# EAGLE design bubbledisplayfrontpack.v01 (EAGLE 6.6.0)
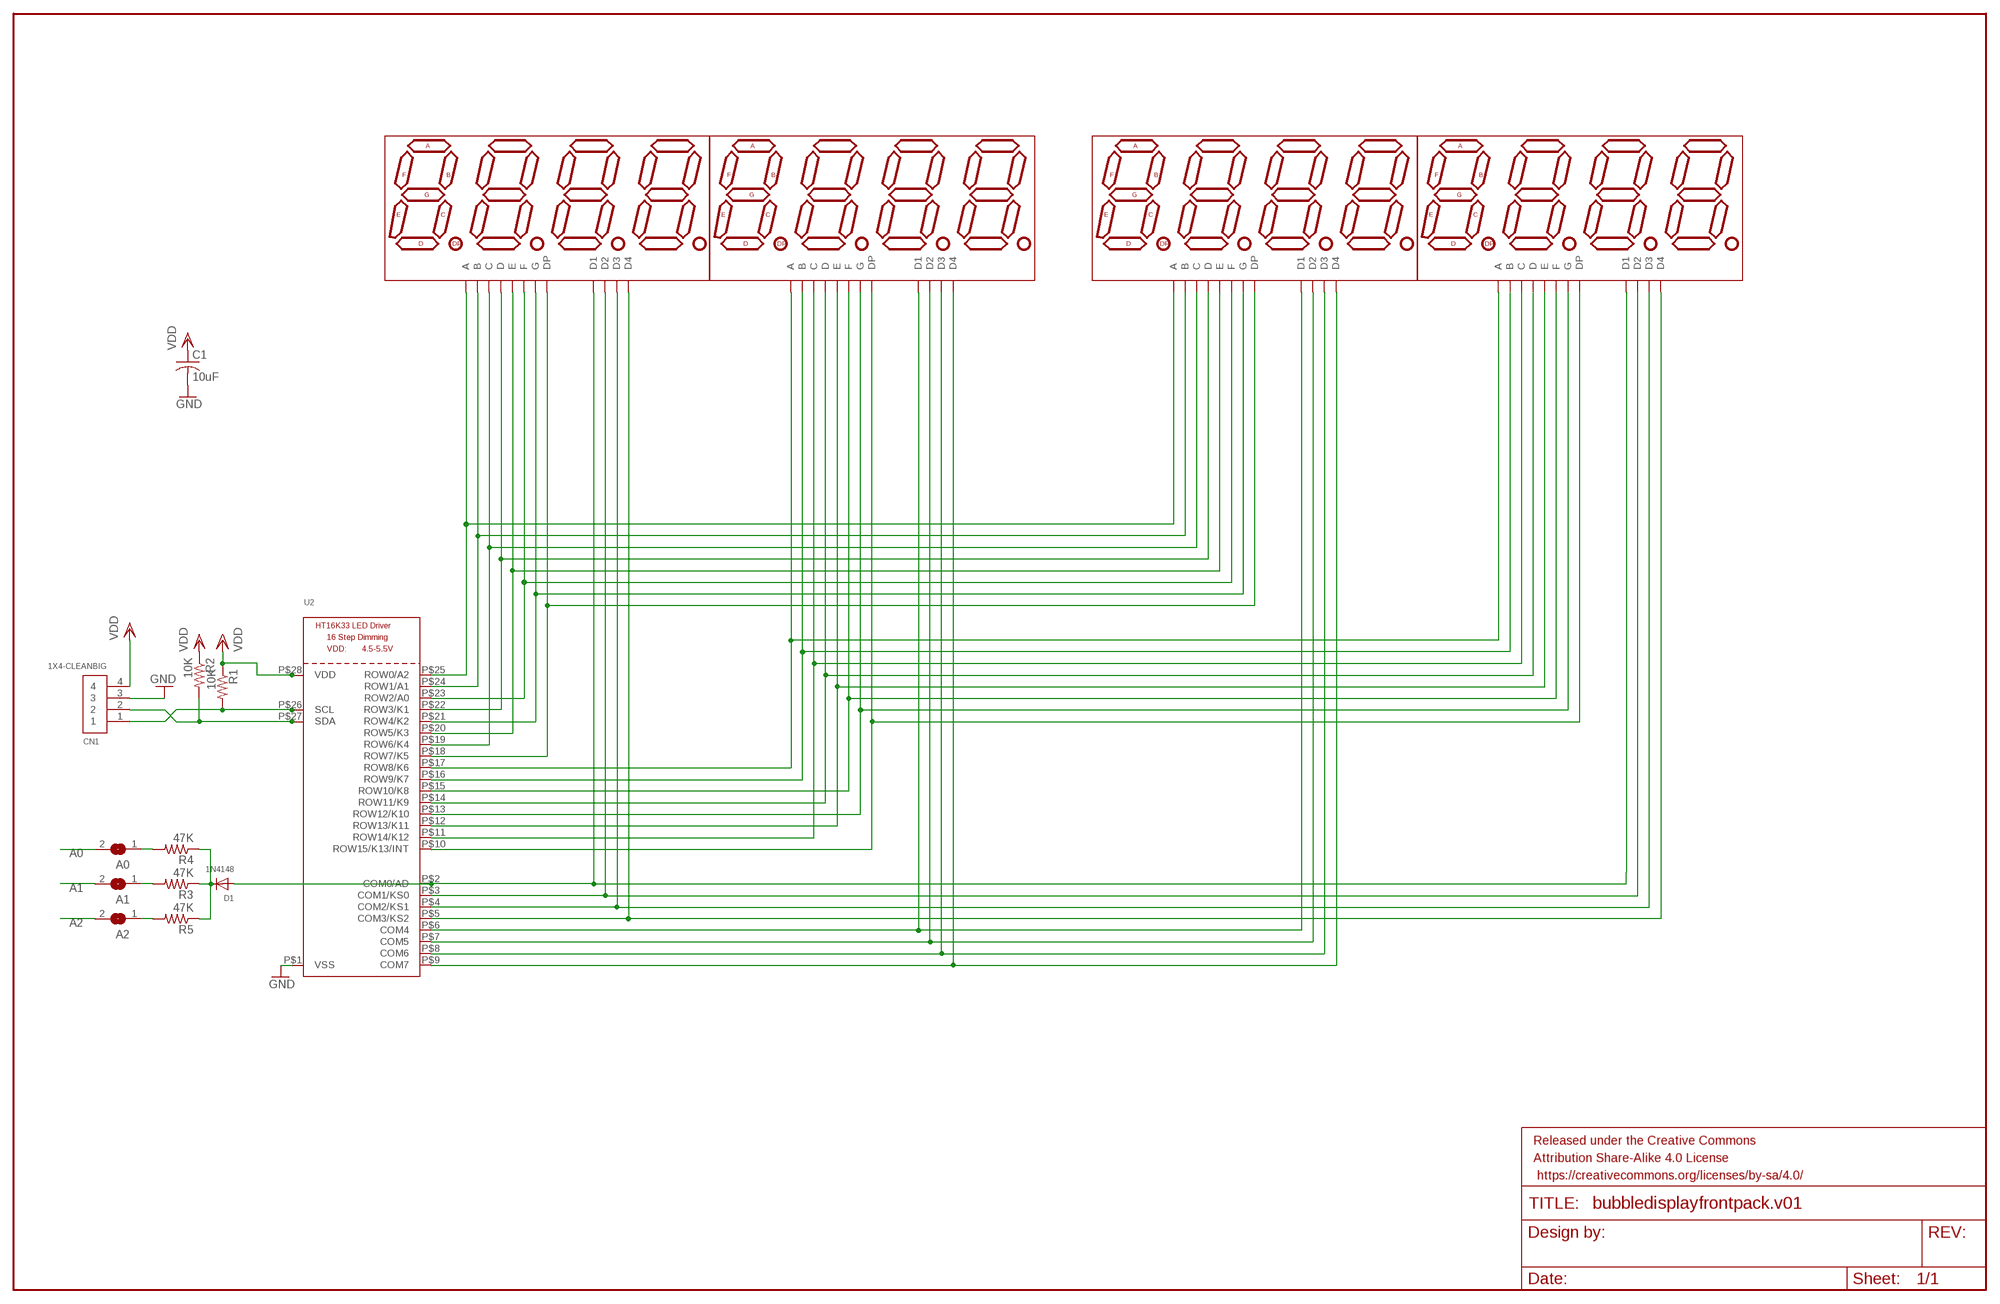
[diagram p0: schematic, sheet 1]

## Parts
A0  SOLDERJUMPERREFLOW_NOPASTE  [SOLDERJUMPER_REFLOW_NOPASTE]
A1  SOLDERJUMPERREFLOW_NOPASTE  [SOLDERJUMPER_REFLOW_NOPASTE]
A2  SOLDERJUMPERREFLOW_NOPASTE  [SOLDERJUMPER_REFLOW_NOPASTE]
C1  10uF  C-USC0805K  [C0805K]
CN1  1X4-CLEANBIG  [1X04-CLEANBIG]
D1  1N4148  DIODESOD-323F  [SOD-323F]
DISPLAY1  hp  7-SEGMENT-4DIGIT-COUNTER-HP-BUBBLE  [DIL12]
DISPLAY2  hp  7-SEGMENT-4DIGIT-COUNTER-HP-BUBBLE  [DIL12]
DISPLAY3  hp  7-SEGMENT-4DIGIT-COUNTER-HP-BUBBLE  [DIL12]
DISPLAY4  hp  7-SEGMENT-4DIGIT-COUNTER-HP-BUBBLE  [DIL12]
FRAME1  FRAME-LEDGER  [CREATIVE_COMMONS]
R1  10K  R-US_R0805  [R0805]
R2  10K  R-US_R0805  [R0805]
R3  47K  R-US_R0805  [R0805]
R4  47K  R-US_R0805  [R0805]
R5  47K  R-US_R0805  [R0805]
U2  HT16K33_SOP28  [SOP28_300MIL]

## Nets
A0: A0.2 DISPLAY1.9(F) DISPLAY3.9(F) U2.P$23(ROW2/A0)
A1: A1.2 DISPLAY1.11(B) DISPLAY3.11(B) U2.P$24(ROW1/A1)
A2: A2.2 DISPLAY1.12(A) DISPLAY3.12(A) U2.P$25(ROW0/A2)
C0P1: D1.A DISPLAY2.1(D1) DISPLAY3.1(D1) U2.P$2(COM0/AD)
C1P10: DISPLAY2.10(D2) DISPLAY3.10(D2) U2.P$3(COM1/KS0)
C2P4: DISPLAY2.4(D3) DISPLAY3.4(D3) U2.P$4(COM2/KS1)
C3P6: DISPLAY2.6(D4) DISPLAY3.6(D4) U2.P$5(COM3/KS2)
C4P1: DISPLAY1.1(D1) DISPLAY4.1(D1) U2.P$6(COM4)
C5P10: DISPLAY1.10(D2) DISPLAY4.10(D2) U2.P$7(COM5)
C6P4: DISPLAY1.4(D3) DISPLAY4.4(D3) U2.P$8(COM6)
C7P6: DISPLAY1.6(D4) DISPLAY4.6(D4) U2.P$9(COM7)
GND: C1.2 CN1.3 U2.P$1(VSS)
N$1: D1.C R3.1 R4.1 R5.1
N$3: DISPLAY1.8(D) DISPLAY3.8(D) U2.P$22(ROW3/K1)
N$5: DISPLAY2.9(F) DISPLAY4.9(F) U2.P$15(ROW10/K8)
N$7: A2.1 R5.2
N$8: DISPLAY2.2(E) DISPLAY4.2(E) U2.P$12(ROW13/K11)
N$19: A1.1 R3.2
N$20: A0.1 R4.2
SCL: CN1.1 R1.2 U2.P$26(SCL)
SDA: CN1.2 R2.2 U2.P$27(SDA)
SEGAD24P12: DISPLAY2.12(A) DISPLAY4.12(A) U2.P$17(ROW8/K6)
SEGBD24P11: DISPLAY2.11(B) DISPLAY4.11(B) U2.P$16(ROW9/K7)
SEGCP3: DISPLAY2.3(C) DISPLAY4.3(C) U2.P$11(ROW14/K12)
SEGD13EP2: DISPLAY1.7(G) DISPLAY3.7(G) U2.P$21(ROW4/K2)
SEGD13GP7: DISPLAY1.3(C) DISPLAY3.3(C) U2.P$19(ROW6/K4)
SEGDD24P8: DISPLAY2.8(D) DISPLAY4.8(D) U2.P$14(ROW11/K9)
SEGDPD13P5: DISPLAY1.5(DP) DISPLAY3.5(DP) U2.P$18(ROW7/K5)
SEGDPP5: DISPLAY2.5(DP) DISPLAY4.5(DP) U2.P$10(ROW15/K13/INT)
SEGED13P2: DISPLAY1.2(E) DISPLAY3.2(E) U2.P$20(ROW5/K3)
SEGFP9: DISPLAY2.7(G) DISPLAY4.7(G) U2.P$13(ROW12/K10)
VDD: C1.1 CN1.4 R1.1 R2.1 U2.P$28(VDD)

## Library data of the parts
A0 A1 A2 = microbuilder:SOLDERJUMPER: SMD Solder JUMPER Solder the two pads together to create a connection, or remove the solder to break it. REFLOW - Use this footprint for solder paste and reflow ovens. WAVE - Use this footprint for hand-soldering (larger pads). CLOSED - Has a trace between the two pads to ensure it is closed by default. The trace needs to be cut to disable the jumper, and can be closed again by creating a solder bridge between the two pads.
C1 = adafruit:C-US: CAPACITOR, American symbol
CN1 = adafruit:1X4: 4-pin connector
D1 = adafruit:DIODE: Diode SMADIODE - SMA Surface Mount Package 20V 1A Schottky Diode Digikey: 641-1014-6-ND DO-1N4148 - Through Hole Small Current Diode SOD-123 20V 1 A (.5mV Vf) Schottky Diode - Digikey: MBRX120TPMSCT-ND SOD-323 10V 570mA (.38mV Vf, 3ns) Schottky Diode - Digikey: ZLLS410CT-ND SOD-523 30V 30mA Schottky Diode (RB751S-40TE61) - Digikey: RB751S-40TE61CT-ND SOT23-R/W - SOT23 Package (R = Solder Paste/Reflow Ovens, W = Hand-Soldering) BAT54Film 40V 300mA - Digikey: 497-7162-1-ND
DISPLAY1-DISPLAY4 = SparkFun-Displays:7-SEGMENT-4DIGIT-COUNTER
FRAME1 = SparkFun-Aesthetics:FRAME-LEDGER: Schematic Frame Standard 11x14 US Ledger frame
R1-R5 = adafruit:R-US_: RESISTOR, American symbol
U2 = microbuilder:HT16K33_SOP28

## Board
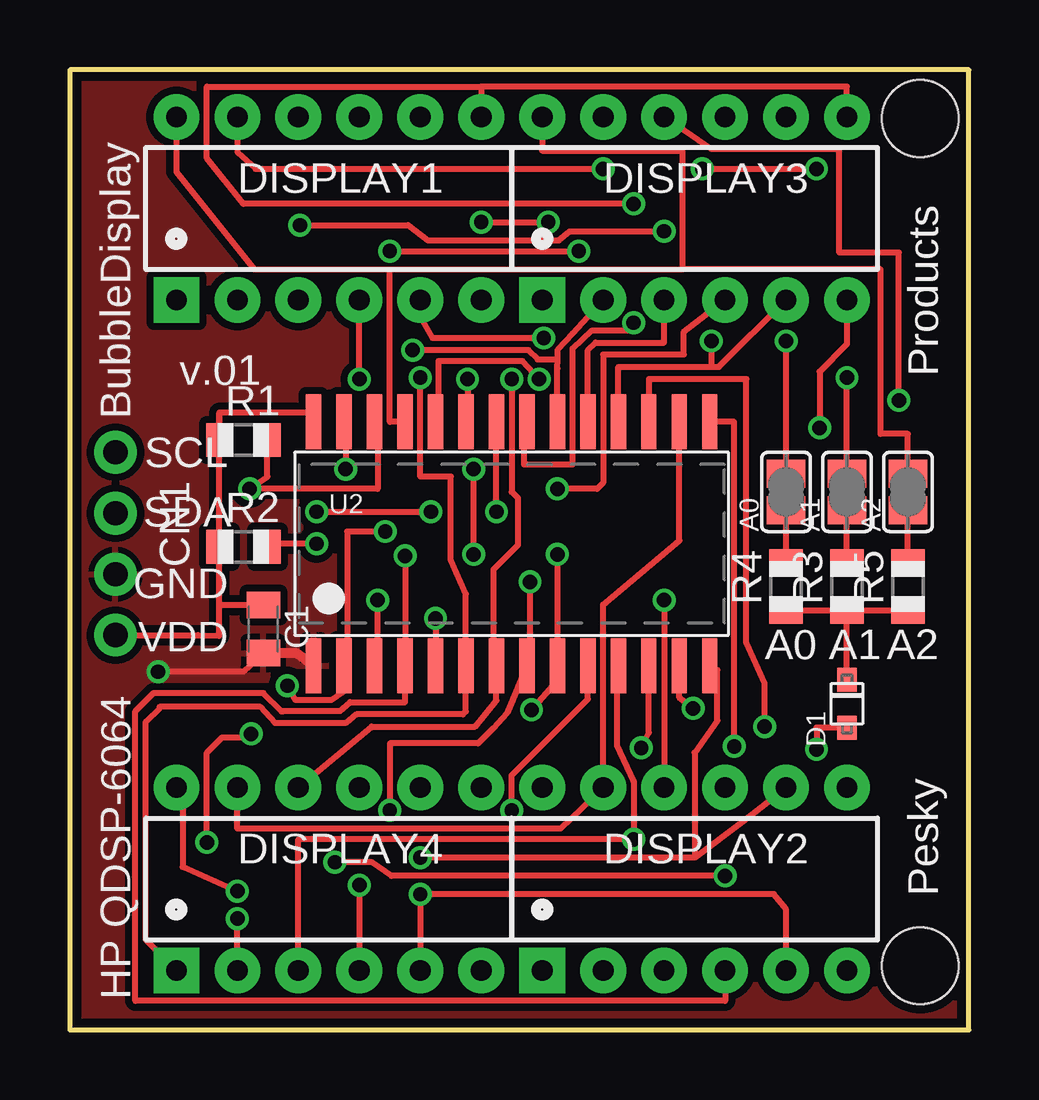
[diagram p1: board, top side]
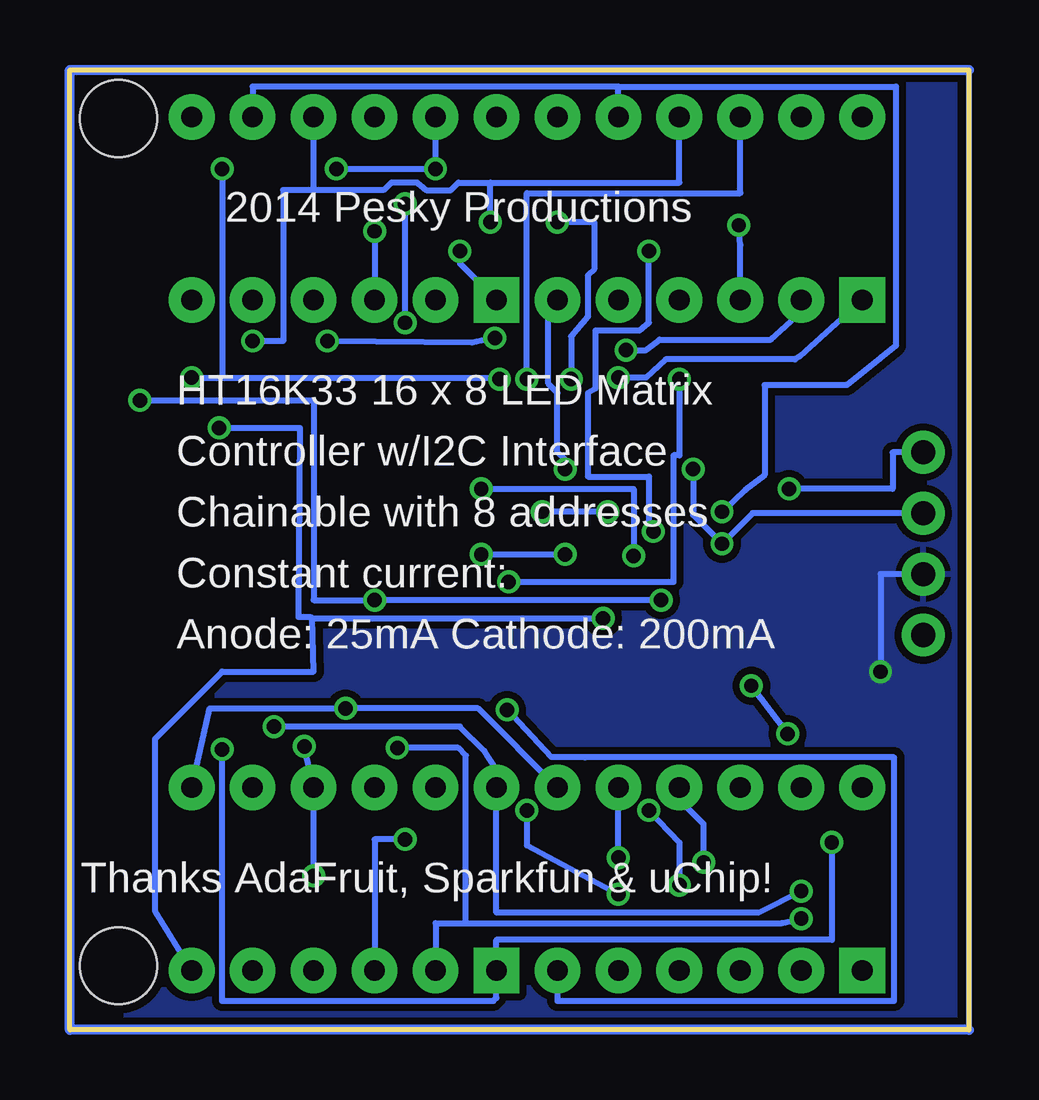
[diagram p2: board, bottom side, seen from below]

Size 37.47 x 40.01 mm. Coordinates in mm from the lower left corner, seen from the top.
Outline: 0,40.01 0,0 37.47,0 37.47,40.01 0,40.01
Copper layers (1*16): Top 0.0356mm / dielectric 1.5011mm / Bottom 0.0356mm
Design rules "OSHPark *": minimum track width 6mil, minimum drill 13mil, track to track 6mil, track to pad 6mil, pad to pad 6mil, via to via 6mil, smd to smd 6mil, copper to edge 15mil, drill to drill 6mil, minimum pad ring 7mil, minimum via ring 7mil, stop-mask expansion 3mil, vias tented up to drill 25mil, thermal gap 10mil
Holes 3.2 mm at 35.43,37.97 35.43,2.67

### Footprints (pad centres in the part's own frame; a part is rotated, then mirrored left to right if it is on the bottom)
SOLDERJUMPER_REFLOW_NOPASTE = smd 1.168 x 1.6: 1 -0.762,0; 2 0.762,0
C0805K = smd 1.1 x 1.4: 1 -1,0; 2 1,0
1X04-CLEANBIG = drill 1.016 pad 1.778: 1 -3.81,0; 2 -1.27,0; 3 1.27,0; 4 3.81,0
SOD-323F = smd 1 x 0.8: A -1,0; C 1,0
DIL12 = drill 0.864 pad 1.905 square: 1 -6.35,-3.81 | drill 0.864 pad 1.905: 2 -3.81,-3.81; 3 -1.27,-3.81; 4 1.27,-3.81; 5 3.81,-3.81; 6 6.35,-3.81; 7 6.35,3.81; 8 3.81,3.81; 9 1.27,3.81; 10 -1.27,3.81; 11 -3.81,3.81; 12 -6.35,3.81
R0805 = smd 1.1 x 1.4: 1 -1,0; 2 1,0
SOP28_300MIL = smd 0.635 x 2.286: P$1 -8.255,-5.08; P$2 -6.985,-5.08; P$3 -5.715,-5.08; P$4 -4.445,-5.08; P$5 -3.175,-5.08; P$6 -1.905,-5.08; P$7 -0.635,-5.08; P$8 0.635,-5.08; P$9 1.905,-5.08; P$10 3.175,-5.08; P$11 4.445,-5.08; P$12 5.715,-5.08; P$13 6.985,-5.08; P$14 8.255,-5.08; P$15 8.255,5.08; P$16 6.985,5.08; P$17 5.715,5.08; P$18 4.445,5.08; P$19 3.175,5.08; P$20 1.905,5.08; P$21 0.635,5.08; P$22 -0.635,5.08; P$23 -1.905,5.08; P$24 -3.175,5.08; P$25 -4.445,5.08; P$26 -5.715,5.08; P$27 -6.985,5.08; P$28 -8.255,5.08

### Placement (x,y rotation side)
A0  29.84,22.42 90 top
A1  32.38,22.42 90 top
A2  34.92,22.42 90 top
C1  8.06,16.7 270 top
CN1  1.91,20.26 270 top
D1  32.38,13.59 90 top
DISPLAY1  10.79,34.23 0 top
DISPLAY2  26.04,6.29 0 top
DISPLAY3  26.04,34.23 0 top
DISPLAY4  10.79,6.29 0 top
FRAME1  -26.67,-7.62 0 top  (outside the outline)
R1  7.24,24.57 0 top
R2  7.24,20.13 0 top
R3  32.38,18.48 90 top
R4  29.84,18.48 90 top
R5  34.92,18.48 90 top
U2  18.41,20.26 0 top

### Tracks (layer width: path | path; a pad name or v marks a point on that pad's centre or on a via)
A0  (via drill 0.6)
  Top 0.254: A0.2 v29.84,28.7 | U2.P$23 16.64,25.34 v16.57,27.11 | v17.14,33.66 v19.94,33.66
  Bottom 0.254: 27.3,34.99 DISPLAY3.9 | DISPLAY1.9 12.06,35.31 19.94,35.31 | v17.14,33.66 15.62,33.66 15.62,31.69 15.88,31.43 15.88,29.72 16.57,28.89 v16.57,27.11 | v19.94,33.66 19.94,35.31 | 27.3,34.99 28.57,34.99 28.57,28.7 v29.84,28.7 | 19.94,35.31 21.27,35.31 21.59,34.99 22.61,34.99 22.99,35.31 24.07,35.31 24.38,34.99 27.3,34.99
A1  (via drill 0.6)
  Top 0.254: A1.2 v32.38,27.18 | U2.P$24 15.37,25.34 15.37,27.88 18.86,27.88 v19.56,27.11 | DISPLAY1.11 6.99,36.58 7.75,35.88 v22.23,35.88 | v26.35,35.88 v31.11,35.88
  Bottom 0.254: DISPLAY3.11 v22.23,35.88 v26.35,35.88 | v19.56,27.11 19.56,27.18 31.11,27.18 | v32.38,27.18 31.11,27.18 | v31.11,35.88 31.11,27.18
A2
  Top 0.254: 25.53,31.69 33.78,31.69 33.78,24.83 34.92,24.83 A2.2 | U2.P$25 13.34,25.34 13.34,31.69 | 13.34,31.69 25.53,31.69 | DISPLAY1.12 4.45,35.75 7.68,31.69 13.34,31.69 | DISPLAY3.12 19.68,36.64 25.53,36.64 25.53,31.69
C0P1  (via drill 0.6)
  Top 0.254: v13.14,20.77 11.56,20.77 11.56,15.94 11.43,15.81 U2.P$2 11.48,15.06 11.48,14.15 10.88,13.74 9.41,13.74 v9.07,14.34 | v31.11,11.68 31.11,12.59 D1.A | v13.34,32.45 v21.21,32.45 | v5.71,7.81 5.71,11.56 6.35,12.19 7.42,12.19 v7.56,12.33
  Bottom 0.254: v9.07,14.34 v7.56,12.33 | v5.71,7.81 5.71,3.75 19.68,3.75 DISPLAY2.1 19.68,1.33 19.81,1.21 31.11,1.21 v31.11,11.68 | v13.14,20.77 13.34,20.77 13.34,23.05 15.88,23.05 15.88,26.54 15.56,26.73 15.56,29.15 13.72,29.15 13.34,29.46 v13.34,32.45 | v21.21,32.45 21.21,31.94 DISPLAY3.1
C1P10  (via drill 0.6)
  Top 0.254: v24.77,17.91 DISPLAY2.10 | DISPLAY3.10 26.73,36.7 32.07,36.7 32.07,32.38 34.54,32.38 v34.54,26.23 | U2.P$3 12.83,15.3 v12.83,17.91
  Bottom 0.254: v34.54,26.23 27.3,26.23 27.3,17.91 v24.77,17.91 v12.83,17.91
C2P4  (via drill 0.6)
  Top 0.254: v20.32,22.54 21.97,22.54 22.23,22.8 22.23,28.13 25.59,28.13 25.59,29.08 DISPLAY3.4 | v13.97,19.75 U2.P$4 13.97,13.65 11.68,13.65 11.25,13.28 8.9,13.28 8.89,13.27 8.83,13.27 8.06,14.03 3.48,14.03 2.73,13.28 2.73,1.21 27.3,1.21 DISPLAY2.4
  Bottom 0.254: v20.32,22.54 13.97,22.54 v13.97,19.75
C3P6  (via drill 0.6)
  Top 0.254: v15.24,17.14 U2.P$5 | DISPLAY3.6 32.38,28.57 31.24,27.43 v31.24,25.08
  Bottom 0.254: DISPLAY2.6 33.91,4.95 33.91,12.13 31.11,14.92 27.3,14.92 27.37,17.14 | 27.37,17.14 v15.24,17.14 | 27.37,17.14 27.43,17.21 27.94,17.21 27.88,25.08 v31.24,25.08
C4P1  (via drill 0.6)
  Top 0.254: v14.61,27.18 14.61,23.05 15.88,23.05 15.88,19.56 16.51,18.16 U2.P$6 16.51,13.27 16.38,13.14 11.94,13.14 11.49,12.78 8.56,12.78 7.94,13.46 3.75,13.46 3.75,13.41 3.17,12.84 3.17,3.75 DISPLAY4.1
  Bottom 0.254: DISPLAY1.1 7.05,28.07 7.24,27.94 12.64,27.94 13.46,27.18 v14.61,27.18
C5P10  (via drill 0.6)
  Top 0.254: DISPLAY4.10 12.57,12.64 16.89,12.64 17.78,13.72 U2.P$7 17.65,15.3 17.65,19.18 18.67,20.19 18.67,22.16 18.41,22.42 v18.41,27.11
  Bottom 0.254: v18.41,27.11 18.41,34.86 9.53,34.86 DISPLAY1.10
C6P4  (via drill 0.6)
  Top 0.254: v12.06,6.03 DISPLAY4.4 | v12.06,27.11 DISPLAY1.4 | v13.34,9.14 13.34,11.94 17.02,11.94 17.65,12.57 18.22,13.21 U2.P$8 19.18,15.3 v19.18,18.67
  Bottom 0.254: v13.34,9.14 12.06,7.81 v12.06,6.03 | v19.18,18.67 12.32,18.67 12.32,23.94 12.06,23.94 v12.06,27.11
C7P6  (via drill 0.6)
  Top 0.254: U2.P$9 20.45,15.3 | v16.83,19.81 v16.83,23.37 | v19.24,13.34 20.32,14.54 U2.P$9 | v20.32,19.81 U2.P$9
  Bottom 0.254: v20.32,19.81 v16.83,19.81 | DISPLAY4.6 17.14,1.21 3.11,1.21 3.11,11.35 16,11.35 17.4,11.37 v19.24,13.34 | v16.83,23.37 16.83,23.75 17.14,24.07 17.14,26.54 17.53,26.92 17.53,30.04 DISPLAY1.6
GND  (via drill 0.6)
  Top 0.254: C1.2 7.24,14.92 v3.68,14.92
  Top 0.406: U2.P$1 9.46,15.68 C1.2
  Bottom 0.254: CN1.3 3.68,18.99 v3.68,14.92
  pour Top (isolate 0.305): 0,40.01 0,0 37.47,0 37.47,40.01
  pour Bottom (isolate 0.305): 0,40.01 0,0 37.47,0 37.47,40.01
N$1
  Top 0.254: D1.C R3.1 | R4.1 R3.1 | R3.1 R5.1
N$3  (via drill 0.6)
  Top 0.254: v10.29,21.59 v15.05,21.59 | v17.78,21.59 U2.P$22
  Bottom 0.254: DISPLAY1.8 14.61,39.31 | 14.61,39.31 29.84,39.31 DISPLAY3.8 | 14.61,39.31 3.05,39.31 3.05,28.51 5.08,26.86 8.51,26.86 8.51,23.11 9.34,22.48 v10.29,21.59 | v15.05,21.59 v17.78,21.59
N$4
  Bottom 0.254: 0,40.01 0,0
  Bottom 0.406: 0,0 37.47,0 37.47,40.01 0,40.01
N$5  (via drill 0.6)
  Top 0.254: v27.69,11.81 27.69,25.34 U2.P$15 | v27.3,6.41 13.4,6.41 12.57,6.99 v11.05,6.99
  Bottom 0.254: v27.69,11.81 DISPLAY2.9 v27.3,6.41 | v11.05,6.99 11.05,8.57 12.06,9.59 DISPLAY4.9
N$7
  Top 0.254: R5.2 A2.1
N$8  (via drill 0.6)
  Top 0.254: DISPLAY4.2 v6.99,4.64 | v23.81,11.75 24.13,12.38 U2.P$12
  Bottom 0.254: DISPLAY2.2 22.23,4.45 20.95,4.45 | 20.95,4.45 20.95,11.43 21.27,11.75 v23.81,11.75 | 20.95,4.45 7.81,4.45 v6.99,4.64
N$19
  Top 0.254: R3.2 A1.1
N$20
  Top 0.254: R4.2 A0.1
SCL  (via drill 0.6)
  Top 0.254: R1.2 8.24,23.05 v7.49,22.54 12.83,22.54 12.83,25.21 | 12.83,25.21 12.83,25.34 U2.P$26 12.83,25.21
  Bottom 0.254: CN1.1 3.17,24.07 3.17,22.54 v7.49,22.54
SDA  (via drill 0.6)
  Top 0.254: v10.29,20.26 8.51,20.26 R2.2 | U2.P$27 11.3,25.34 11.3,25.08 11.49,25.08 v11.49,23.37
  Bottom 0.254: CN1.2 9.02,21.53 v10.29,20.26 11.49,21.46 v11.49,23.37
SEGAD24P12  (via drill 0.6)
  Top 0.254: DISPLAY4.12 4.7,9.84 4.7,6.79 v6.99,5.78 | v28.96,12.64 28.96,14.41 28.19,16.13 28.19,27.11 24.13,27.11 U2.P$17
  Bottom 0.254: v28.96,12.64 21.21,12.64 20.19,11.62 19.68,10.86 DISPLAY2.12 19.68,4.89 8.76,4.89 v6.99,5.78
SEGBD24P11
  Top 0.254: U2.P$16 25.4,20.38 22.23,17.72 DISPLAY2.11 20.45,8.38 6.99,8.38 DISPLAY4.11
SEGCP3  (via drill 0.6)
  Top 0.254: DISPLAY4.3 9.53,7.94 v23.5,7.94 23.5,10.35 22.8,11.87 22.8,15.11 U2.P$11
  Bottom 0.254: v23.5,7.94 24.77,7.94 DISPLAY2.3
SEGD13EP2  (via drill 0.6)
  Top 0.254: DISPLAY3.7 32.38,39.31 17.14,39.31 | 17.14,39.31 DISPLAY1.7 | U2.P$21 18.92,25.21 18.92,23.56 20.95,23.56 20.95,28.38 21.78,29.15 23.5,29.15 v23.5,29.46 23.5,29.65 | v23.5,34.42 7.24,34.42 5.71,36.32 5.71,39.31 17.14,39.31
  Bottom 0.254: v23.5,29.46 v23.5,34.42
SEGD13GP7  (via drill 0.6)
  Top 0.254: U2.P$19 21.59,28.32 21.91,28.64 24.77,28.64 DISPLAY3.3 | v9.59,33.53 14.1,33.53 14.92,32.89 20.38,32.89 20.83,33.27 v24.77,33.27
  Bottom 0.254: DISPLAY1.3 9.53,32.7 v9.59,33.53 | v24.77,33.27 DISPLAY3.3
SEGDD24P8  (via drill 0.6)
  Top 0.254: 26.04,7.18 26.04,11.56 26.99,12.89 26.99,14.99 U2.P$14 | 26.04,7.18 v14.61,7.18 | 26.04,7.18 28.07,8.7 DISPLAY2.8
  Bottom 0.254: v14.61,7.18 DISPLAY4.8
SEGDPD13P5  (via drill 0.6)
  Top 0.254: U2.P$18 22.86,27.62 26.73,27.62 | 26.73,27.62 27.05,27.62 DISPLAY3.5 | DISPLAY1.5 14.61,29.72 15.11,28.83 v19.75,28.83 | v26.73,28.7 26.73,27.62
  Bottom 0.254: v19.75,28.83 20.7,28.64 v26.73,28.7
SEGDPP5  (via drill 0.6)
  Top 0.254: 21.66,14.26 U2.P$10 21.59,13.78 18.41,10.6 v18.41,9.14 | DISPLAY4.5 v14.61,5.65 29.34,5.65 29.84,5.02 DISPLAY2.5
  Bottom 0.254: v18.41,9.14 18.41,7.68 v14.61,5.65
SEGED13P2  (via drill 0.6)
  Top 0.254: v14.29,28.32 19.11,28.32 19.49,27.94 20.32,27.94 20.33,27.93 | DISPLAY3.2 20.95,29.02 20.34,28.35 20.33,27.93 | U2.P$20 20.32,27.56 20.33,27.93
  Bottom 0.254: DISPLAY1.2 6.99,29.91 8.26,28.77 12.89,28.77 13.46,28.32 v14.29,28.32
SEGFP9  (via drill 0.6)
  Top 0.254: v25.97,13.4 25.4,13.84 U2.P$13
  Bottom 0.254: DISPLAY4.7 20.45,13.4 v25.97,13.4 31.62,13.4 DISPLAY2.7
VDD
  Top 0.254: C1.1 6.24,17.7 | 6.24,17.7 R2.1 R1.1 6.24,25.72 | 6.24,17.7 6.22,16.41 5.33,16.45 CN1.4 | U2.P$28 10.16,25.72 6.24,25.72 | 6.22,24.57 6.24,25.72

### Text on the board
tPlace: v.01 | Products | BubbleDisplay | SCL | SDA | GND | VDD | A0 | A1 | A2 | Pesky | HP QDSP-6064
bPlace: 2014 Pesky Productions | HT16K33 16 x 8 LED Matrix | Controller w/I2C Interface | Chainable with 8 addresses | Constant current: | Anode: 25mA Cathode: 200mA | Thanks AdaFruit, Sparkfun & uChip!